# Altium project AdcDacBoard6.PrjPcb
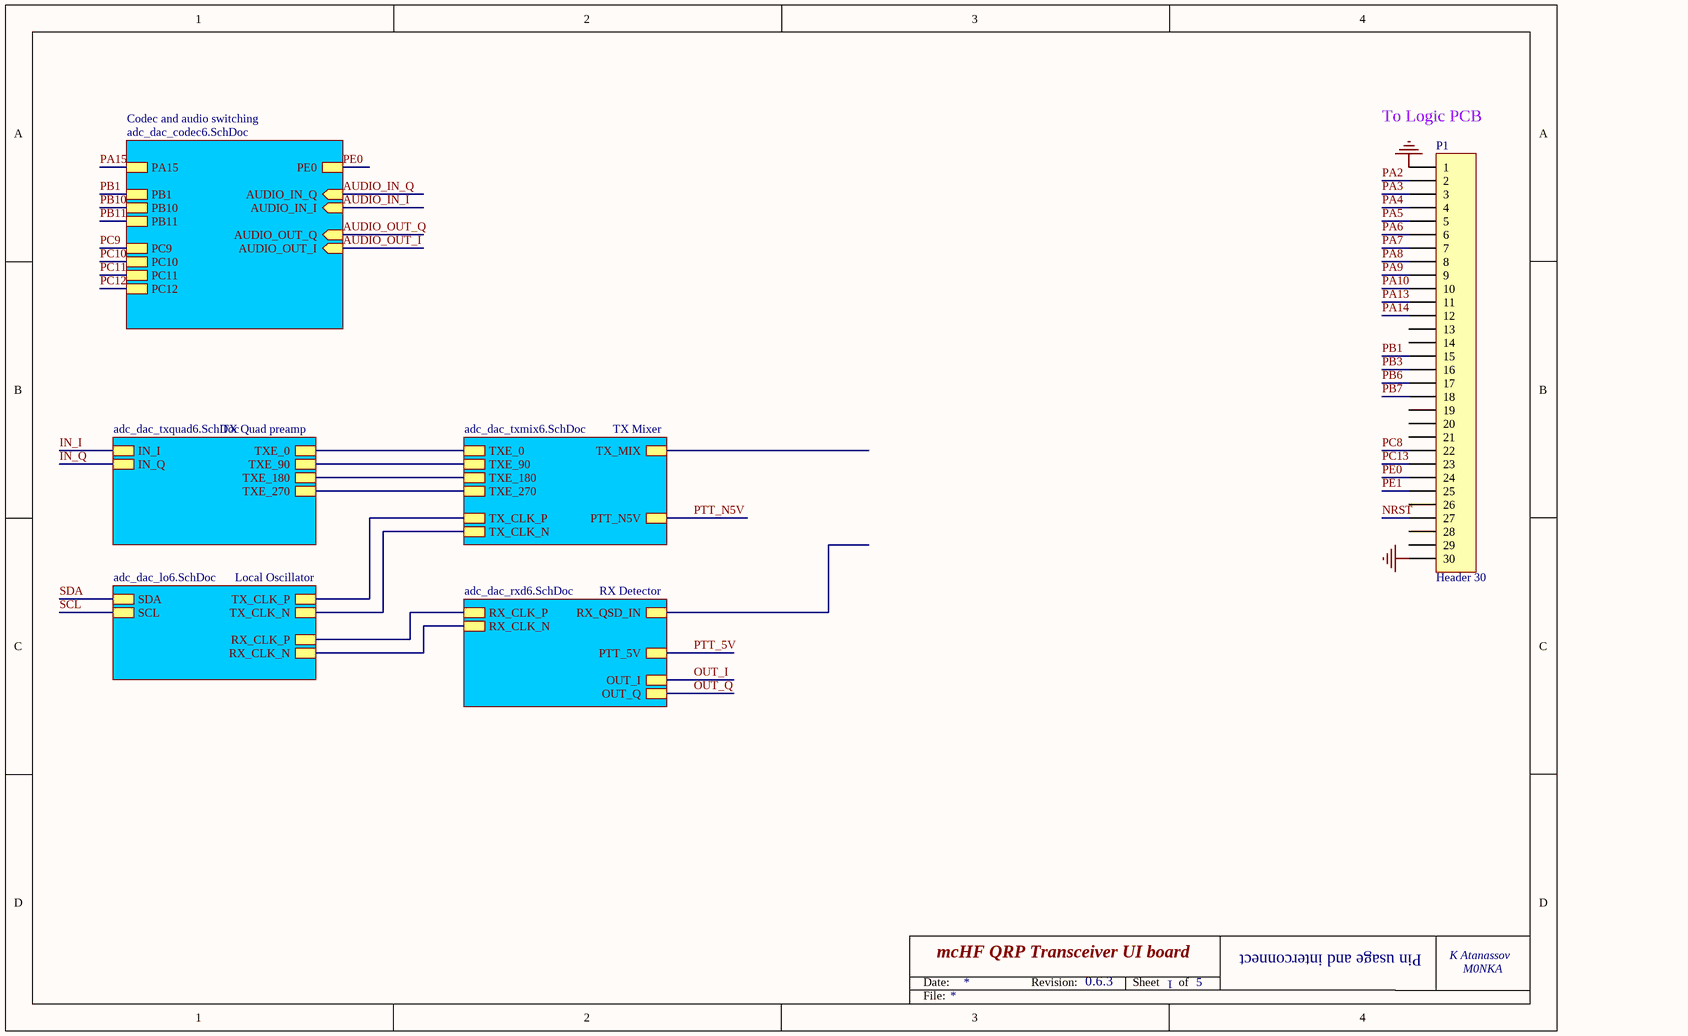
[diagram p0: adc_dac_main6.SchDoc]
3 sheets, 42 parts. Net scope: hierarchical (ports join the sheet entries above them; power ports are global).
Sheets:
  adc_dac_main6.SchDoc
    TX Quad preamp = adc_dac_txquad6.SchDoc
    Local Oscillator = adc_dac_lo6.SchDoc

## Sheet adc_dac_main6.SchDoc: mcHF QRP Transceiver UI board
size A4; Author: K Atanassov; CompanyName: M0NKA; Revision: 0.6.3; SheetTotal: 5

### Parts
P1  Header 30  [HDR1X30]

### Sub-sheets
Codec and audio switching = adc_dac_codec6.SchDoc (file not in this document): PA15, PB1, PB10, PB11, PC9, PC11, PC10, PC12, PE0, AUDIO_IN_Q (in), AUDIO_IN_I (in), AUDIO_OUT_Q (in), AUDIO_OUT_I (in)
Local Oscillator = adc_dac_lo6.SchDoc: SDA, SCL, RX_CLK_N, RX_CLK_P, TX_CLK_P, TX_CLK_N
RX Detector = adc_dac_rxd6.SchDoc (file not in this document): RX_QSD_IN, OUT_I, OUT_Q, PTT_5V, RX_CLK_N, RX_CLK_P
TX Mixer = adc_dac_txmix6.SchDoc (file not in this document): PTT_N5V, TX_MIX, TXE_270, TXE_180, TXE_90, TXE_0, TX_CLK_P, TX_CLK_N
TX Quad preamp = adc_dac_txquad6.SchDoc: IN_I, IN_Q, TXE_0, TXE_90, TXE_180, TXE_270

### Nets
GND: P1.1 P1.30
AUDIO_IN_I: sheet Codec and audio switching/AUDIO_IN_I
AUDIO_IN_Q: sheet Codec and audio switching/AUDIO_IN_Q
AUDIO_OUT_I: sheet Codec and audio switching/AUDIO_OUT_I
AUDIO_OUT_Q: sheet Codec and audio switching/AUDIO_OUT_Q
NRST: P1.27
OUT_I: sheet RX Detector/OUT_I
OUT_Q: sheet RX Detector/OUT_Q
PA2: P1.2
PA3: P1.3
PA4: P1.4
PA5: P1.5
PA6: P1.6
PA7: P1.7
PA8: P1.8
PA9: P1.9
PA10: P1.10
PA13: P1.11
PA14: P1.12
PA15: sheet Codec and audio switching/PA15
PB1: P1.15 ; sheet Codec and audio switching/PB1
PB3: P1.16
PB6: P1.17
PB7: P1.18
PB10: sheet Codec and audio switching/PB10
PB11: sheet Codec and audio switching/PB11
PC8: P1.22
PC9: sheet Codec and audio switching/PC9
PC10: sheet Codec and audio switching/PC10
PC11: sheet Codec and audio switching/PC11
PC12: sheet Codec and audio switching/PC12
PC13: P1.23
PE0: P1.24 ; sheet Codec and audio switching/PE0
PE1: P1.25
PTT_5V: sheet RX Detector/PTT_5V
PTT_N5V: sheet TX Mixer/PTT_N5V
RX_CLK_N: sheet RX Detector/RX_CLK_N, sheet Local Oscillator/RX_CLK_N
RX_CLK_P: sheet RX Detector/RX_CLK_P, sheet Local Oscillator/RX_CLK_P
TX_CLK_N: sheet Local Oscillator/TX_CLK_N, sheet TX Mixer/TX_CLK_N
TX_CLK_P: sheet Local Oscillator/TX_CLK_P, sheet TX Mixer/TX_CLK_P
NetC109_2: sheet TX Quad preamp/TXE_0, sheet TX Mixer/TXE_0
NetC110_2: sheet TX Quad preamp/TXE_180, sheet TX Mixer/TXE_180
NetC111_2: sheet TX Quad preamp/TXE_270, sheet TX Mixer/TXE_270
NetC112_2: sheet TX Quad preamp/TXE_90, sheet TX Mixer/TXE_90

Not connected (* = marked no-connect by the designer): P1 13 14 19 20 21 26 28 29

### Notes on the sheet
- (near P1) To Logic PCB
- 1
- Pin usage and interconnect
- Date:
- Revision:
- Sheet
- of
- File:

### Library data of the parts
P1 = Header 30: Header, 30-Pin; Order: NA; Price: 0.295

## Sheet adc_dac_txquad6.SchDoc: mcHF QRP Transceiver RF board
size A4; Author: K Atanassov; CompanyName: M0NKA; Revision: 0.6.3; SheetTotal: 12
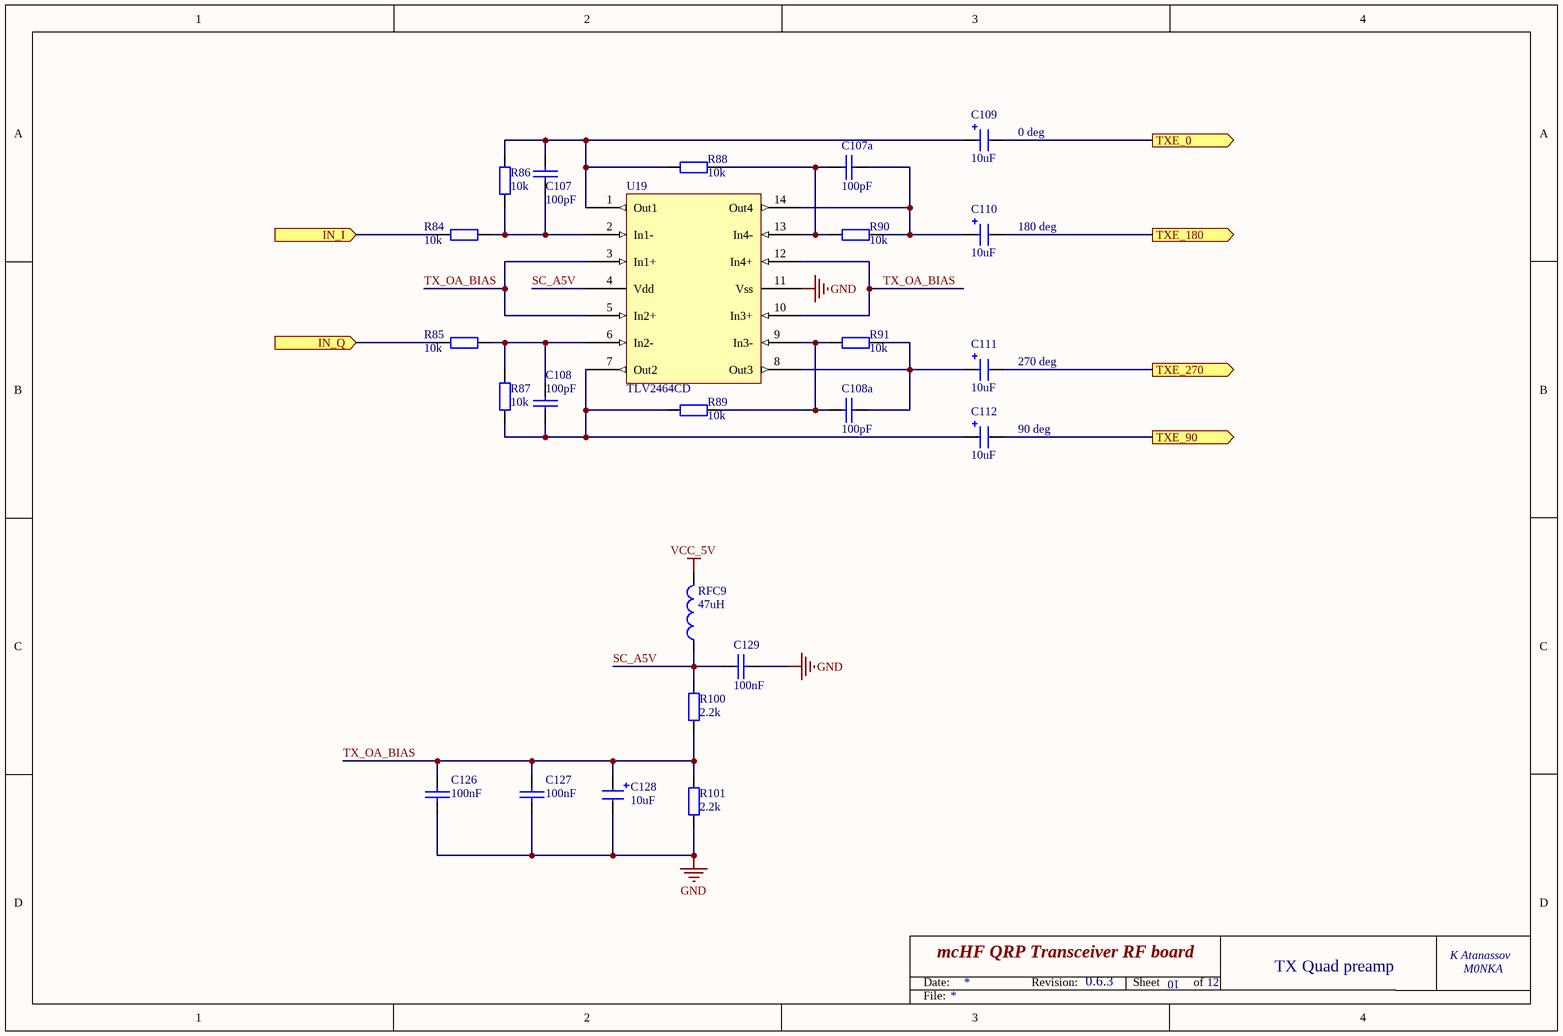
[diagram p1: adc_dac_txquad6.SchDoc]

### Parts
C107  100pF  [0805-Pro]
C107a  100pF  [0805-Pro]
C108  100pF  [0805-Pro]
C108a  100pF  [0805-Pro]
C109  10uF  [1206_Elec_Cap_N]
C110  10uF  [1206_Elec_Cap_N]
C111  10uF  [1206_Elec_Cap_N]
C112  10uF  [1206_Elec_Cap_N]
C126  100nF  [0805-Pro]
C127  100nF  [0805-Pro]
C128  10uF  [1206_Elec_Cap_N]
C129  100nF  [0805-Pro]
R84  10k  [0805-Pro]
R85  10k  [0805-Pro]
R86  10k  [0805-Pro]
R87  10k  [0805-Pro]
R88  10k  [0805-Pro]
R89  10k  [0805-Pro]
R90  10k  [0805-Pro]
R91  10k  [0805-Pro]
R100  2.2k  [0805-Pro]
R101  2.2k  [0805-Pro]
RFC9  47uH  [0805-Pro]
U19  TLV2464CD  [SO-14-Pro]

### Ports
IN_I (in), IN_Q (in), TXE_0 (out), TXE_90 (out), TXE_180 (out), TXE_270 (out)

### Nets
GND: C126.1 C127.1 C128.2 C129.1 R101.1 U19.11(Vss)
VCC_5V: RFC9.2
IN_I: R84.1 ; port IN_I
IN_Q: R85.1 ; port IN_Q
SC_A5V: C129.2 R100.2 RFC9.1 U19.4(Vdd)
TX_OA_BIAS: C126.2 C127.2 C128.1 R100.1 R101.2 U19.3(In1+) U19.5(In2+) U19.10(In3+) U19.12(In4+)
NetC107_1: C107.1 R84.2 R86.1 U19.2(In1-)
NetC107_2: C107.2 C109.1 R86.2 R88.1 U19.1(Out1)
NetC107a_1: C107a.1 C110.1 R90.2 U19.14(Out4)
NetC107a_2: C107a.2 R88.2 R90.1 U19.13(In4-)
NetC108_1: C108.1 C112.1 R87.1 R89.1 U19.7(Out2)
NetC108_2: C108.2 R85.2 R87.2 U19.6(In2-)
NetC108a_1: C108a.1 C111.1 R91.2 U19.8(Out3)
NetC108a_2: C108a.2 R89.2 R91.1 U19.9(In3-)
NetC109_2: C109.2 ; port TXE_0
NetC110_2: C110.2 ; port TXE_180
NetC111_2: C111.2 ; port TXE_270
NetC112_2: C112.2 ; port TXE_90

### Notes on the sheet
- (near C109) 0 deg
- (near C110) 180 deg
- (near C111) 270 deg
- (near C112) 90 deg
- 10
- TX Quad preamp
- Date:
- Revision:
- Sheet
- of
- File:

### Library data of the parts
C107 C107a C108 C108a = CAP: Capacitor; Order: FN 233-2692; Price: 0.056
C109-C112 C128 = CAP-POL: Electrolitic capacitor; Order: FN 233-3009; QT Order: QCC-00166; Price: 0.204
C126 C127 C129 = CAP: Capacitor; Order: FN 252-2090; QT Order: QCC-00154; Price: 0.068
R84-R91 = RES: Resistor; Order: FN 146-9856; QT Order: QCR-00349; Price: 0.021
R100 R101 = RES: Resistor; Order: FN 188-7289; QT Order: QCR-00333; Price: 0.046
RFC9 = TDK-NLV25T: INDUCTOR, SIGNAL LINE, 4.7UH, 1005; Order: FN 166-9895; Price: 0.166
U19 = TLV2464CD: Low Power, Rail-To-Rail OpAmp; Order: FN 845-5171; Price: 1.47

## Sheet adc_dac_lo6.SchDoc: mcHF QRP Transceiver RF board
size A4; Author: K Atanassov; CompanyName: M0NKA; Revision: 0.6.3; SheetTotal: 12
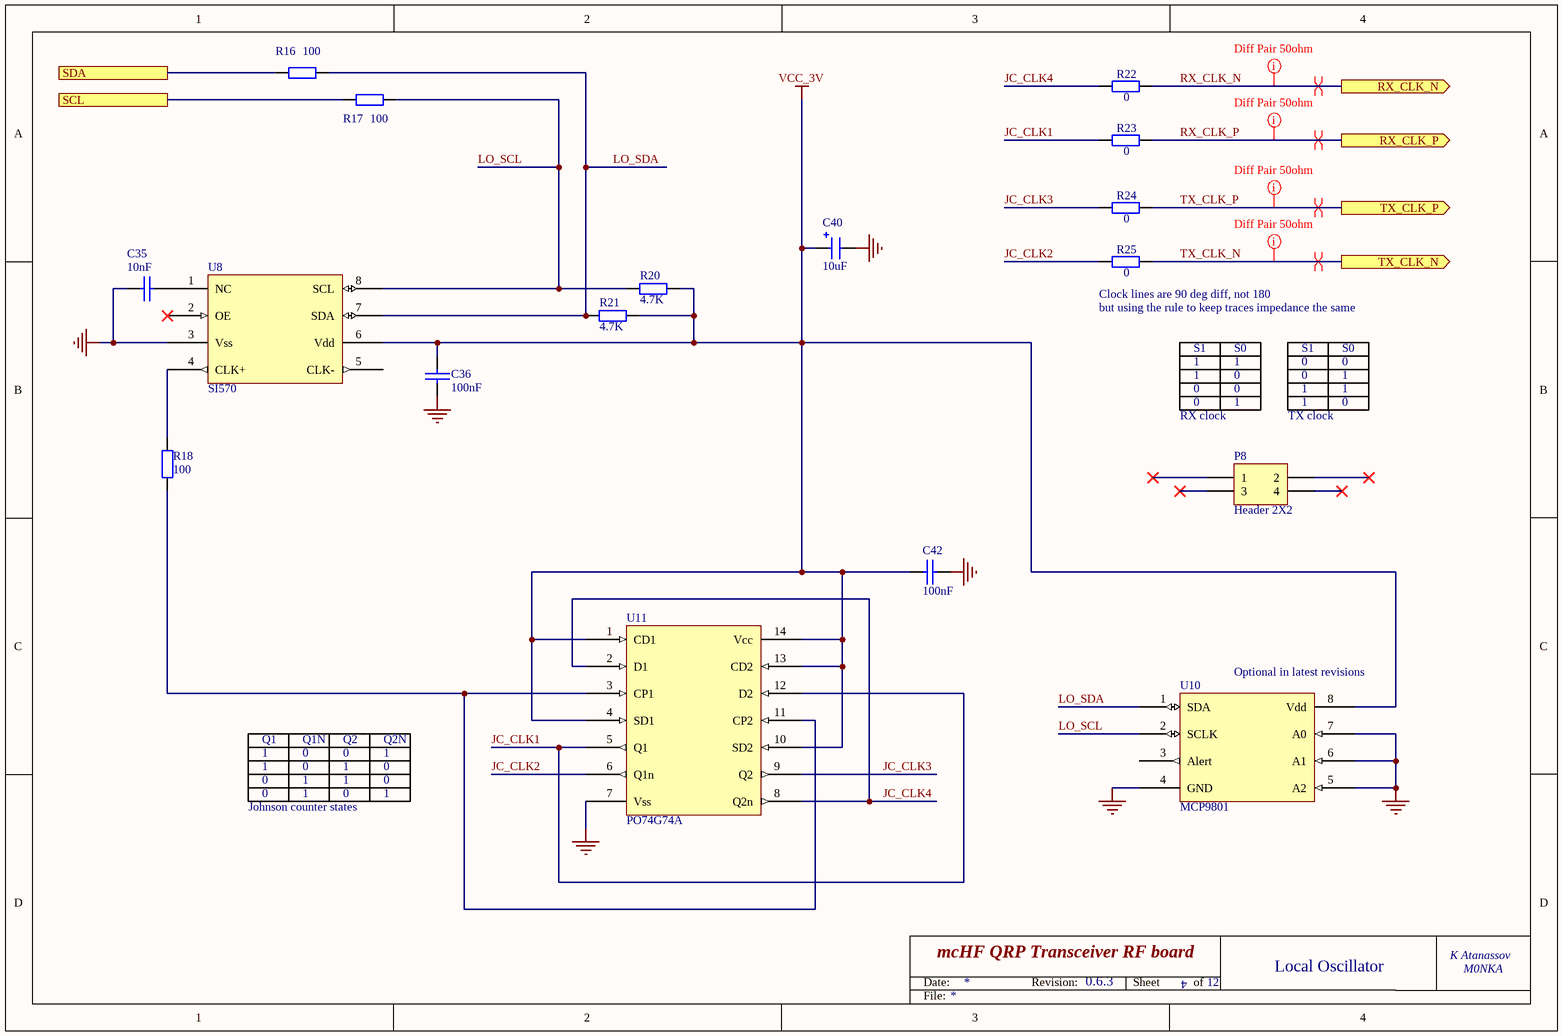
[diagram p2: adc_dac_lo6.SchDoc]

### Parts
C35  10nF  [0805-Pro]
C36  100nF  [0805-Pro]
C40  10uF  [1206_Elec_Cap_N]
C42  100nF  [0805-Pro]
P8  Header 2X2  [HDR2X2]
R16  100  [0805-Pro]
R17  100  [0805-Pro]
R18  100  [0805-Pro]
R20  4.7K  [0805-Pro]
R21  4.7K  [0805-Pro]
R22  0  [0805-Pro]
R23  0  [0805-Pro]
R24  0  [0805-Pro]
R25  0  [0805-Pro]
U8  SI570  [SI570_m]
U10  MCP9801  [SO-8]  (no BOM)
U11  PO74G74A  [SO-14-Pro]

### Ports
RX_CLK_N (out), RX_CLK_P (out), SCL, SDA, TX_CLK_N (out), TX_CLK_P (out)

### Nets
GND: C35.1 C36.2 C40.2 C42.1 U8.3(Vss) U10.4(GND) U10.5(A2) U10.6(A1) U10.7(A0) U11.7(Vss)
VCC_3V: C36.1 C40.1 C42.2 R20.2 R21.2 U8.6(Vdd) U10.8(Vdd) U11.1(CD1) U11.4(SD1) U11.10(SD2) U11.13(CD2) U11.14(Vcc)
JC_CLK1: R23.2 U11.5(Q1) U11.12(D2)
JC_CLK2: R25.2 U11.6(Q1n)
JC_CLK3: R24.2 U11.9(Q2)
JC_CLK4: R22.2 U11.2(D1) U11.8(Q2n)
LO_SCL: R17.1 R20.1 U8.8(SCL) U10.2(SCLK)
LO_SDA: R16.1 R21.1 U8.7(SDA) U10.1(SDA)
RX_CLK_N: R22.1 ; port RX_CLK_N
RX_CLK_P: R23.1 ; port RX_CLK_P
SCL: R17.2 ; port SCL
SDA: R16.2 ; port SDA
TX_CLK_N: R25.1 ; port TX_CLK_N
TX_CLK_P: R24.1 ; port TX_CLK_P
NetC35_2: C35.2 U8.1(NC)
NetR18_1: R18.1 U11.3(CP1) U11.11(CP2)
NetR18_2: R18.2 U8.4(CLK+)

Not connected (* = marked no-connect by the designer): P8 1* 2* 3* 4*; U8 2(OE)* 5(CLK-); U10 3(Alert)

### Layout directives
differential pair: RX_CLK_N, RX_CLK_P, TX_CLK_N, TX_CLK_P
rule Matched Net Lengths [Tolerance = 150mil]: RX_CLK_N, RX_CLK_P, TX_CLK_N, TX_CLK_P

### Notes on the sheet
- (near R25) Clock lines are 90 deg diff, not 180
- (near R25) but using the rule to keep traces impedance the same
- S1
- 1
- S0
- 0
- RX clock
- TX clock
- (near U10) Optional in latest revisions
- Q1
- Q1N
- Q2
- Q2N
- Johnson counter states
- 4
- Local Oscillator
- Date:
- Revision:
- Sheet
- of
- File:

### Library data of the parts
C35 = CAP: Capacitor; Order: FN 233-2713; QT Order: QCC-00097; Price: 0.059
C36 C42 = CAP: as C126 on sheet adc_dac_txquad6; Price: 0.068
C40 = CAP-POL: as C109 on sheet adc_dac_txquad6; Price: 0.204
P8 = Header 2X2: Header, 2-Pin, Dual row; LatestRevisionDate: 17-Jul-2002; LatestRevisionNote: Re-released for DXP Platform.; Publisher: Altium Limited
R16-R18 = RES: Resistor; Order: FN 933-2375; QT Order: QCR-00301; Price: 0.027
R20 R21 = RES: Resistor; Order: FN 200-8383; QT Order: QCR-00341; Price: 0.024
R22-R25 = RES: Resistor; Order: FN 933-3681; QT Order: QCR-00268; Price: 0.009
U8 = SI570: I2C programmable XO; Order: DK 336-2518-ND; Price: 8.72
U10 = MCP9801: 2-Wire High-Accuracy Temperature Sensor; Order: FN 143-9486; Price: 1.05
U11 = 74LCX74M: Low Voltage Dual D-Type Positive Edge-Triggered  Flip-Flop with 5V Tolerant Inputs; Order: FN 985-3502; Price: 0.23

## Nets that join several sheets
GND: adc_dac_main6 (P1.1 P1.30), adc_dac_txquad6 (6 pins), adc_dac_lo6 (10 pins)